# Altium schematic sheet 15.RK3588_SARADC_1.8V Only GPIO.SchDoc
size 420 x 297 mm; Revision: V2.1; Schematic Page Number: 11; Page Number: 15; Check: <Checker>; Schematic Name: RK_NVR_DEMO1_RK3588_LP4/4x_V21; Page Count: 43; Page name: 15.RK3588_SARADC/1.8V Only GPIO; Designer: Zhangdz; Schematic Page Count: 99; Revcode: V2.1; DsnPath: E:\Work\SBER\RK3588_SOM\temp\RK_NVR_DEMO1_RK3588_LP4XD200P232SD8_V21_20211228.DSN; SchematicName: RK_NVR_DEMO1_RK3588_LP4/4x_V21; PageName: 15.RK3588_SARADC/1.8V Only GPIO; PageSize: A3; TopSchematic: True
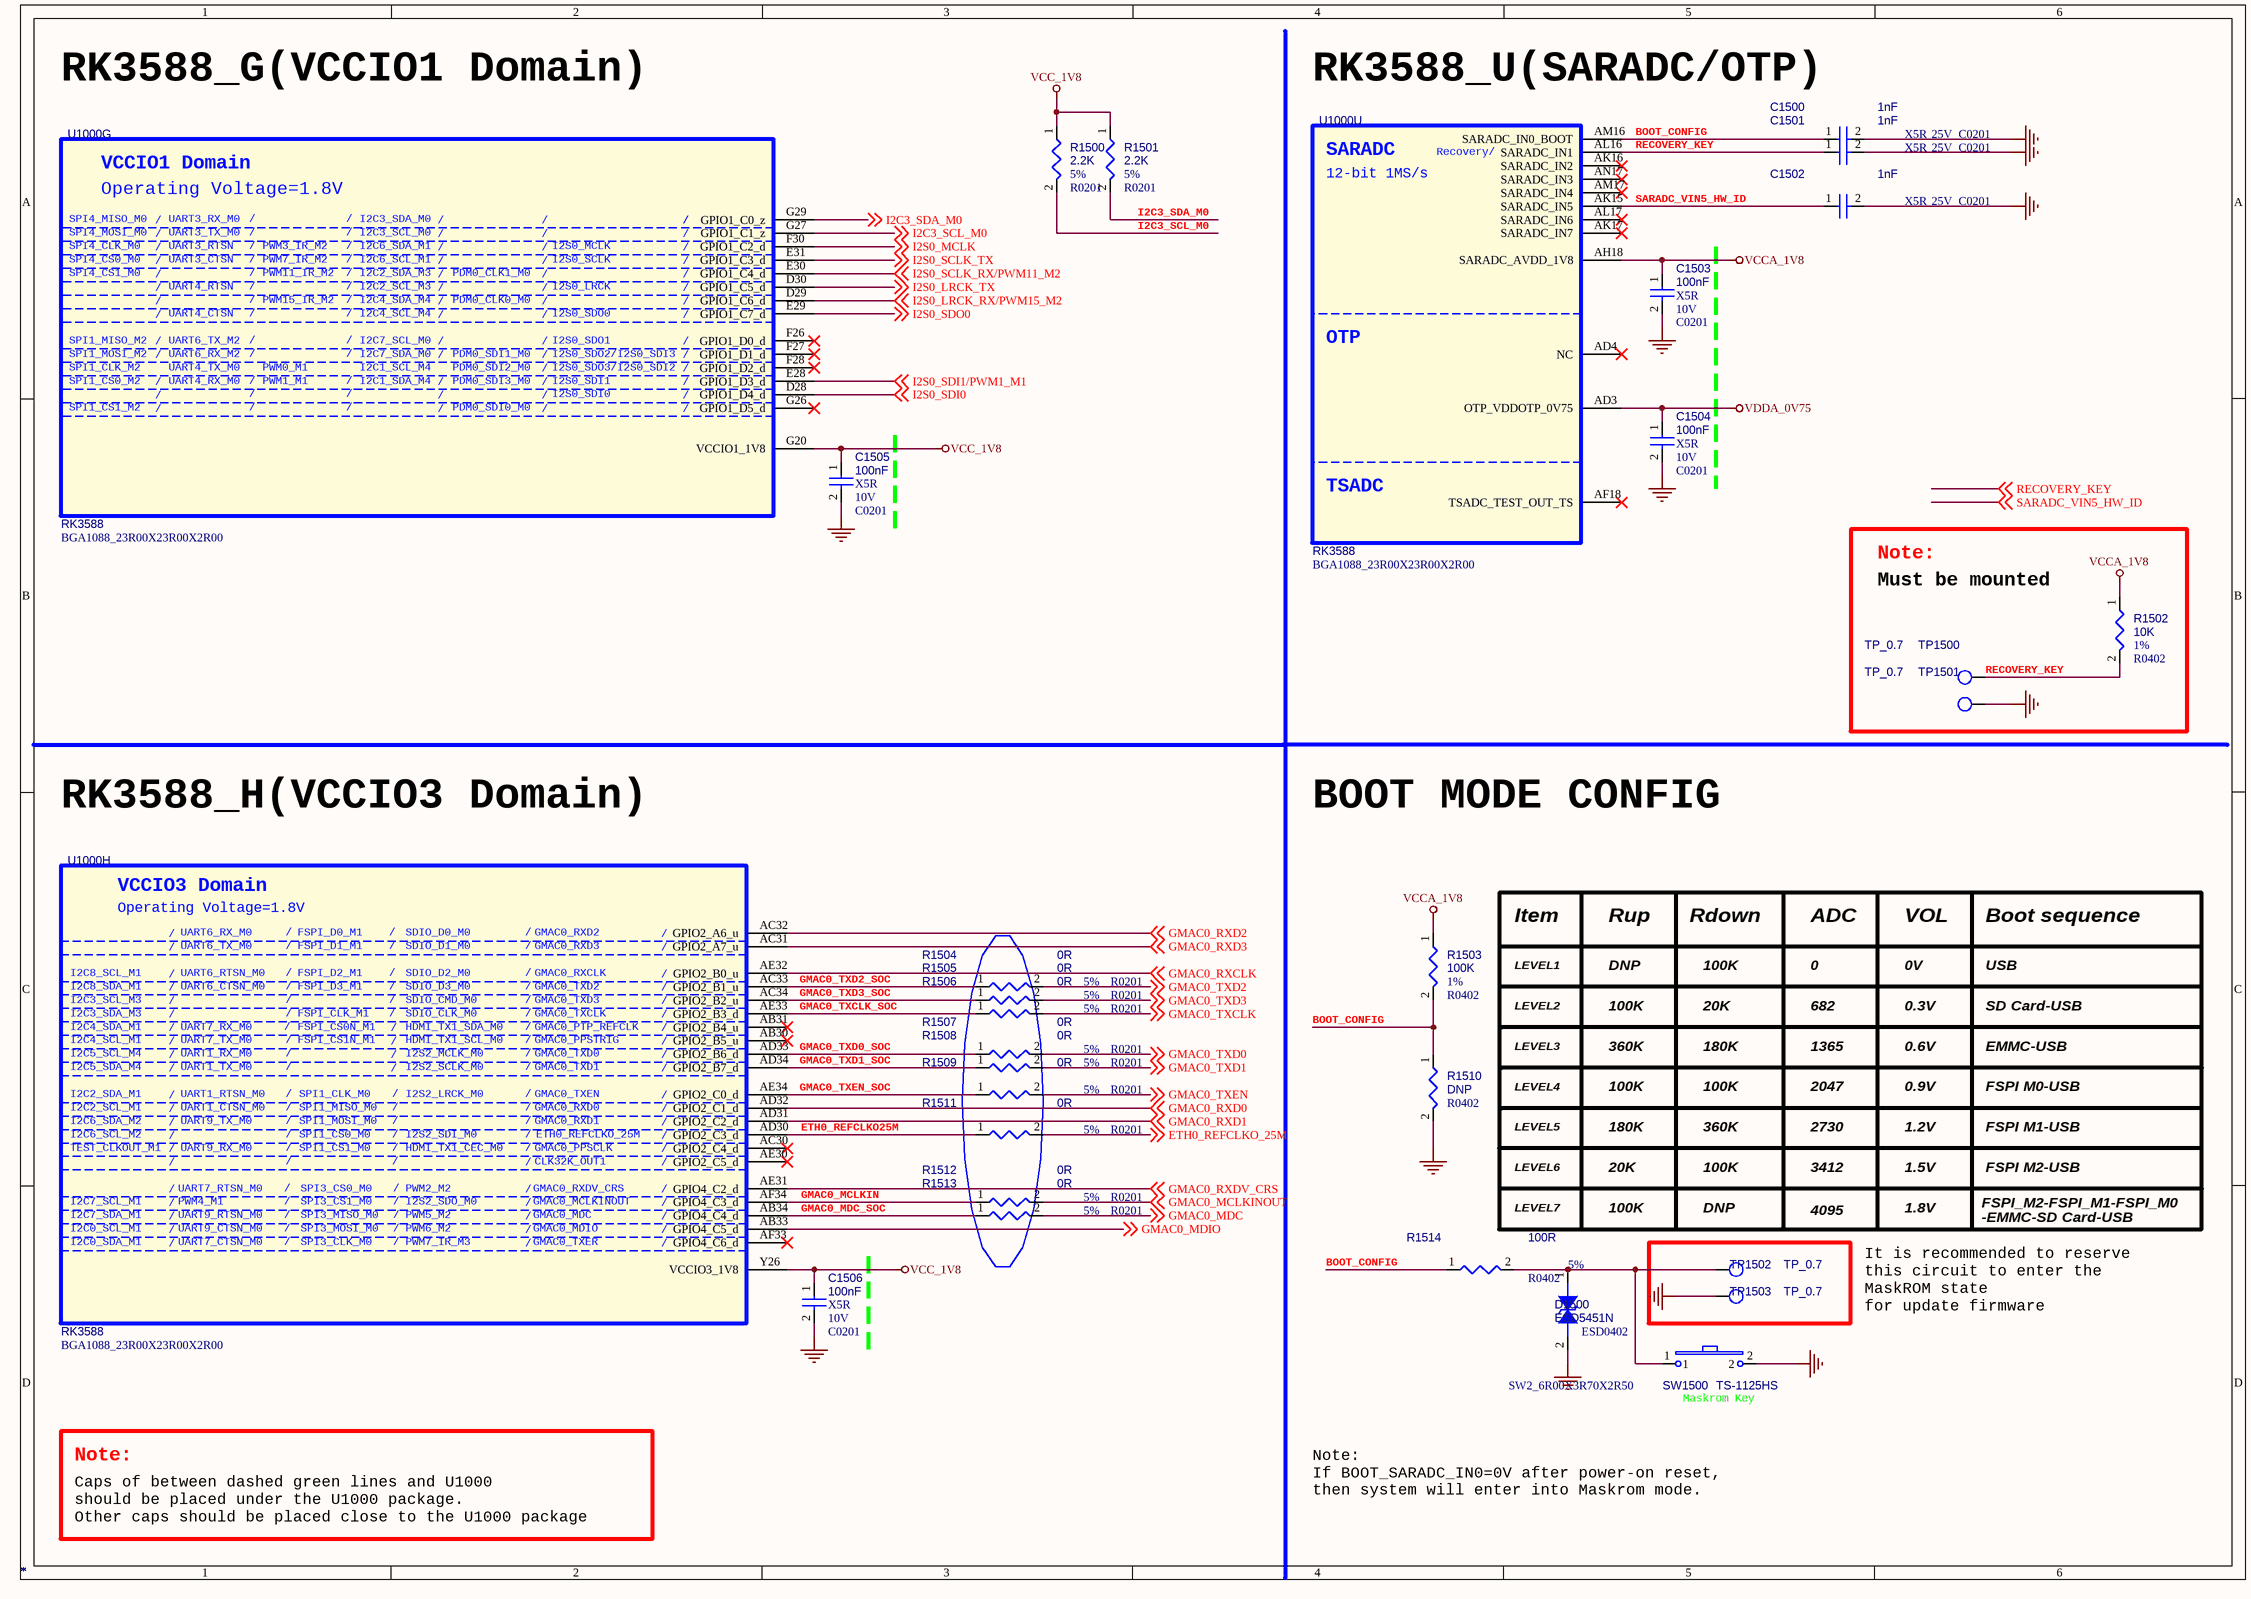
[diagram p0: 15.RK3588_SARADC_1.8V Only GPIO.SchDoc]

## Parts
C1500  *  Voltage: 25V  Dielectric: X5R  [C0201]
C1501  *  Voltage: 25V  Dielectric: X5R  [C0201]
C1502  *  Voltage: 25V  Dielectric: X5R  [C0201]
C1503  *  Voltage: 10V  Dielectric: X5R  [C0201]
C1504  *  Voltage: 10V  Dielectric: X5R  [C0201]
C1505  *  Voltage: 10V  Dielectric: X5R  [C0201]
C1506  *  Voltage: 10V  Dielectric: X5R  [C0201]
D1500  *  [ESD0402]
R1500  *  PCB Footprint: R0201  Tolerance: 5%  [R0402]
R1501  *  PCB Footprint: R0201  Tolerance: 5%  [R0402]
R1502  *  Tolerance: 1%  [R0402]
R1503  *  Tolerance: 1%  [R0402]
R1504  *  PCB Footprint: R0201  Tolerance: 5%  [R0402]
R1505  *  PCB Footprint: R0201  Tolerance: 5%  [R0402]
R1506  *  PCB Footprint: R0201  Tolerance: 5%  [R0402]
R1507  *  PCB Footprint: R0201  Tolerance: 5%  [R0402]
R1508  *  PCB Footprint: R0201  Tolerance: 5%  [R0402]
R1509  *  PCB Footprint: R0201  Tolerance: 5%  [R0402]
R1510  *  [R0402]
R1511  *  PCB Footprint: R0201  Tolerance: 5%  [R0402]
R1512  *  PCB Footprint: R0201  Tolerance: 5%  [R0402]
R1513  *  PCB Footprint: R0201  Tolerance: 5%  [R0402]
R1514  *  Tolerance: 5%  [R0402]
SW1500  *  PCB Footprint: SW2_6R00X3R70X2R50  Option: Maskrom Key  [YC-6615B]
TP1500  *  [TEST]
TP1501  *  [TEST]
TP1502  *  [TEST]
TP1503  *  [TEST]
U1000  *  [BGA1088_23R00X23R00X2R00]  (parts G,H,U of 26)

## Nets
GND: C1500.2 C1501.2 C1502.2 C1503.2 C1504.2 C1505.2 C1506.2 D1500.2 R1510.2 SW1500.2 TP1501.1 TP1503.1
VCC_1V8: C1505.1 C1506.1 R1500.1 R1501.1 U1000.G20(VCCIO1_1V8) U1000.Y26(VCCIO3_1V8)
VCCA_1V8: C1503.1 R1502.1 R1503.1 U1000.AH18(SARADC_AVDD_1V8)
VDDA_0V75: C1504.1 U1000.AD3(OTP_VDDOTP_0V75)
BOOT_CONFIG: C1500.1 R1503.2 R1510.1 R1514.1 U1000.AM16(SARADC_IN0_BOOT)
ETH0_REFCLKO25M: R1511.1 U1000.AD30(GPIO2_C3_d)
ETH0_REFCLKO_25M: R1511.2 ; off-sheet ETH0_REFCLKO_25M
GMAC0_MCLKIN: R1512.1 U1000.AF34(GPIO4_C3_d)
GMAC0_MCLKINOUT: R1512.2 ; off-sheet GMAC0_MCLKINOUT
GMAC0_MDC: R1513.2 ; off-sheet GMAC0_MDC
GMAC0_MDC_SOC: R1513.1 U1000.AB34(GPIO4_C4_d)
GMAC0_MDIO: U1000.AB33(GPIO4_C5_d) ; off-sheet GMAC0_MDIO
GMAC0_RXCLK: U1000.AE32(GPIO2_B0_u) ; off-sheet GMAC0_RXCLK
GMAC0_RXD0: U1000.AD32(GPIO2_C1_d) ; off-sheet GMAC0_RXD0
GMAC0_RXD1: U1000.AD31(GPIO2_C2_d) ; off-sheet GMAC0_RXD1
GMAC0_RXD2: U1000.AC32(GPIO2_A6_u) ; off-sheet GMAC0_RXD2
GMAC0_RXD3: U1000.AC31(GPIO2_A7_u) ; off-sheet GMAC0_RXD3
GMAC0_RXDV_CRS: U1000.AE31(GPIO4_C2_d) ; off-sheet GMAC0_RXDV_CRS
GMAC0_TXCLK: R1506.2 ; off-sheet GMAC0_TXCLK
GMAC0_TXCLK_SOC: R1506.1 U1000.AE33(GPIO2_B3_d)
GMAC0_TXD0: R1507.2 ; off-sheet GMAC0_TXD0
GMAC0_TXD0_SOC: R1507.1 U1000.AD33(GPIO2_B6_d)
GMAC0_TXD1: R1508.2 ; off-sheet GMAC0_TXD1
GMAC0_TXD1_SOC: R1508.1 U1000.AD34(GPIO2_B7_d)
GMAC0_TXD2: R1504.2 ; off-sheet GMAC0_TXD2
GMAC0_TXD2_SOC: R1504.1 U1000.AC33(GPIO2_B1_u)
GMAC0_TXD3: R1505.2 ; off-sheet GMAC0_TXD3
GMAC0_TXD3_SOC: R1505.1 U1000.AC34(GPIO2_B2_u)
GMAC0_TXEN: R1509.2 ; off-sheet GMAC0_TXEN
GMAC0_TXEN_SOC: R1509.1 U1000.AE34(GPIO2_C0_d)
I2C3_SCL_M0: R1500.2 U1000.G27(GPIO1_C1_z) ; off-sheet I2C3_SCL_M0
I2C3_SDA_M0: R1501.2 U1000.G29(GPIO1_C0_z) ; off-sheet I2C3_SDA_M0
I2S0_LRCK_RX/PWM15_M2: U1000.D29(GPIO1_C6_d) ; off-sheet I2S0_LRCK_RX/PWM15_M2
I2S0_LRCK_TX: U1000.D30(GPIO1_C5_d) ; off-sheet I2S0_LRCK_TX
I2S0_MCLK: U1000.F30(GPIO1_C2_d) ; off-sheet I2S0_MCLK
I2S0_SCLK_RX/PWM11_M2: U1000.E30(GPIO1_C4_d) ; off-sheet I2S0_SCLK_RX/PWM11_M2
I2S0_SCLK_TX: U1000.E31(GPIO1_C3_d) ; off-sheet I2S0_SCLK_TX
I2S0_SDI0: U1000.D28(GPIO1_D4_d) ; off-sheet I2S0_SDI0
I2S0_SDI1/PWM1_M1: U1000.E28(GPIO1_D3_d) ; off-sheet I2S0_SDI1/PWM1_M1
I2S0_SDO0: U1000.E29(GPIO1_C7_d) ; off-sheet I2S0_SDO0
RECOVERY_KEY: C1501.1 R1502.2 TP1500.1 U1000.AL16(SARADC_IN1) ; off-sheet RECOVERY_KEY
SARADC_VIN5_HW_ID: C1502.1 U1000.AK15(SARADC_IN5) ; off-sheet SARADC_VIN5_HW_ID
NetD1500_1: D1500.1 R1514.2 SW1500.1 TP1502.1

Not connected (* = marked no-connect by the designer): U1000 AB30(GPIO2_B5_u)* AB31(GPIO2_B4_u)* AC30(GPIO2_C4_d)* AD4(NC)* AE30(GPIO2_C5_d)* AF18(TSADC_TEST_OUT_TS)* AF33(GPIO4_C6_d)* AK16(SARADC_IN2)* AK17(SARADC_IN7)* AL17(SARADC_IN6)* AM17(SARADC_IN4)* AN17(SARADC_IN3)* F26(GPIO1_D0_d)* F27(GPIO1_D1_d)* F28(GPIO1_D2_d)* G26(GPIO1_D5_d)*

## Notes on the sheet
- RK3588_G(VCCIO1 Domain)
- (near U1000) RK3588_U(SARADC/OTP)
- Note:
- Must be mounted
- RK3588_H(VCCIO3 Domain)
- BOOT MODE CONFIG
- Item
- Rup
- Rdown
- ADC
- VOL
- Boot sequence
- LEVEL1
- DNP
- 100K
- 0
- 0V
- USB
- LEVEL2
- LEVEL3
- 360K
- 20K
- 180K
- 682
- 1365
- 0.6V
- 0.3V
- EMMC-USB
- SD Card-USB
- LEVEL4
- LEVEL5
- 2047
- 2730
- 1.2V
- 0.9V
- FSPI M1-USB
- FSPI M0-USB
- LEVEL6
- 3412
- 1.5V
- FSPI M2-USB
- LEVEL7
- 4095
- 1.8V
- FSPI_M2-FSPI_M1-FSPI_M0
  -EMMC-SD Card-USB
- It is recommended to reserve
  this circuit to enter the
  MaskROM state
  for update firmware
- Caps of between dashed green lines and U1000
  should be placed under the U1000 package.
  Other caps should be placed close to the U1000 package
- Note:
  If BOOT_SARADC_IN0=0V after power-on reset,
  then system will enter into Maskrom mode.
- (in symbol SOC_RK3588, part G) VCCIO1 Domain; Operating Voltage=1.8V; SPI4_MISO_M0; /; UART3_RX_M0; I2C3_SDA_M0; SPI4_MOSI_M0; UART3_TX_M0; I2C3_SCL_M0; SPI4_CLK_M0; UART3_RTSN; PWM3_IR_M2; I2C6_SDA_M1; I2S0_MCLK; SPI4_CS0_M0; UART3_CTSN; PWM7_IR_M2; I2C6_SCL_M1; I2S0_SCLK; SPI4_CS1_M0; PWM11_IR_M2; I2C2_SDA_M3; PDM0_CLK1_M0; UART4_RTSN; I2C2_SCL_M3; I2S0_LRCK; PWM15_IR_M2; I2C4_SDA_M4; PDM0_CLK0_M0; UART4_CTSN; I2C4_SCL_M4; I2S0_SDO0; SPI1_MISO_M2; UART6_TX_M2; I2C7_SCL_M0; I2S0_SDO1; SPI1_MOSI_M2; UART6_RX_M2; I2C7_SDA_M0; PDM0_SDI1_M0; I2S0_SDO2/I2S0_SDI3; SPI1_CLK_M2; UART4_TX_M0; PWM0_M1; I2C1_SCL_M4; PDM0_SDI2_M0; I2S0_SDO3/I2S0_SDI2; SPI1_CS0_M2; UART4_RX_M0; PWM1_M1; I2C1_SDA_M4; PDM0_SDI3_M0; I2S0_SDI1; I2S0_SDI0; SPI1_CS1_M2; PDM0_SDI0_M0
- (in symbol SOC_RK3588, part H) VCCIO3 Domain; Operating Voltage=1.8V; /; UART6_RX_M0; FSPI_D0_M1; SDIO_D0_M0; GMAC0_RXD2; UART6_TX_M0; FSPI_D1_M1; SDIO_D1_M0; GMAC0_RXD3; I2C8_SCL_M1; UART6_RTSN_M0; FSPI_D2_M1; SDIO_D2_M0; GMAC0_RXCLK; I2C8_SDA_M1; UART6_CTSN_M0; FSPI_D3_M1; SDIO_D3_M0; GMAC0_TXD2; I2C3_SCL_M3; SDIO_CMD_M0; GMAC0_TXD3; I2C3_SDA_M3; FSPI_CLK_M1; SDIO_CLK_M0; GMAC0_TXCLK; I2C4_SDA_M1; UART7_RX_M0; FSPI_CS0N_M1; HDMI_TX1_SDA_M0; GMAC0_PTP_REFCLK; I2C4_SCL_M1; UART7_TX_M0; FSPI_CS1N_M1; HDMI_TX1_SCL_M0; GMAC0_PPSTRIG; I2C5_SCL_M4; UART1_RX_M0; I2S2_MCLK_M0; GMAC0_TXD0; I2C5_SDA_M4; UART1_TX_M0; I2S2_SCLK_M0; GMAC0_TXD1; I2C2_SDA_M1; UART1_RTSN_M0; SPI1_CLK_M0; I2S2_LRCK_M0; GMAC0_TXEN; I2C2_SCL_M1; UART1_CTSN_M0; SPI1_MISO_M0; GMAC0_RXD0; I2C6_SDA_M2; UART9_TX_M0; SPI1_MOSI_M0; GMAC0_RXD1; I2C6_SCL_M2; SPI1_CS0_M0; I2S2_SDI_M0; ETH0_REFCLKO_25M; TEST_CLKOUT_M1; UART9_RX_M0; SPI1_CS1_M0; HDMI_TX1_CEC_M0; GMAC0_PPSCLK; CLK32K_OUT1; UART7_RTSN_M0; SPI3_CS0_M0; PWM2_M2; GMAC0_RXDV_CRS; I2C7_SCL_M1; PWM4_M1; SPI3_CS1_M0; I2S2_SDO_M0; GMAC0_MCLKINOUT; I2C7_SDA_M1; UART9_RTSN_M0; SPI3_MISO_M0; PWM5_M2; GMAC0_MDC; I2C0_SCL_M1; UART9_CTSN_M0; SPI3_MOSI_M0; PWM6_M2; GMAC0_MDIO; I2C0_SDA_M1; UART7_CTSN_M0; SPI3_CLK_M0; PWM7_IR_M3; GMAC0_TXER
- (in symbol SOC_RK3588, part U) SARADC; Recovery/; 12-bit 1MS/s; OTP; TSADC

## Library data of the parts
C1500 = CAP NP: cap,1.00nF,+/-10%,25V,X5R,C0201; Part Reference: C1500; Manufacturer: TDK; Value: 1nF; RK PN: C0603X5R1E102K030BA; Priority: A; Tolerance: 10%; PCB Footprint: C0201; Part Type: C0201; Manufacturer PN: C0603X5R1E102K030BA; Created by: JJJ
C1501 = CAP NP: cap,1.00nF,+/-10%,25V,X5R,C0201; Part Reference: C1501; Manufacturer: TDK; Value: 1nF; RK PN: C0603X5R1E102K030BA; Priority: A; Tolerance: 10%; PCB Footprint: C0201; Part Type: C0201; Manufacturer PN: C0603X5R1E102K030BA; Created by: JJJ
C1502 = CAP NP: cap,1.00nF,+/-10%,25V,X5R,C0201; Part Reference: C1502; Manufacturer: TDK; Value: 1nF; RK PN: C0603X5R1E102K030BA; Priority: A; Tolerance: 10%; PCB Footprint: C0201; Part Type: C0201; Manufacturer PN: C0603X5R1E102K030BA; Created by: JJJ
C1503 = CAP NP: cap,100.00nF,+/-10%,10V,X5R,C0201; Part Reference: C1503; Manufacturer: TDK; Value: 100nF; RK PN: C0603X5R1A104K030BC; Priority: A; Tolerance: 10%; PCB Footprint: C0201; Part Type: C0201; Manufacturer PN: C0603X5R1A104K030BC; Created by: JJJ
C1504 = CAP NP: cap,100.00nF,+/-10%,10V,X5R,C0201; Part Reference: C1504; Manufacturer PN: C0603X5R1A104K030BC; Manufacturer: TDK; Value: 100nF; Tolerance: 10%; Priority: A; PCB Footprint: C0201; Created by: JJJ; Part Type: C0201; RK PN: C0603X5R1A104K030BC
C1505 = CAP NP: cap,100.00nF,+/-10%,10V,X5R,C0201; Part Reference: C1505; Manufacturer PN: C0603X5R1A104K030BC; Manufacturer: TDK; Value: 100nF; Tolerance: 10%; Priority: A; PCB Footprint: C0201; Created by: JJJ; Part Type: C0201; RK PN: C0603X5R1A104K030BC
C1506 = CAP NP: cap,100.00nF,+/-10%,10V,X5R,C0201; Part Reference: C1506; Manufacturer: TDK; Value: 100nF; RK PN: C0603X5R1A104K030BC; Priority: A; Tolerance: 10%; PCB Footprint: C0201; Part Type: C0201; Manufacturer PN: C0603X5R1A104K030BC; Created by: JJJ
D1500 = DIODE BI_DIR TRIG: 1-Line, Bi-directional, Transient Voltage Suppressors.17.5pF.; Part Reference: D1500; Manufacturer: WillSemi(О¤¶ы°лµјМе); Value: ESD5451N; Priority: A; PCB Footprint: ESD0402; Created by: JJJ; Manufacturer PN: ESD5451N; Part Type: ESD_TVS; RK PN: ESD5451N
R1500 = RESISTOR_Dup1: НЁУГєсД¤µзЧи,2K2,+/-5%,R0201,1/20W.; Part Reference: R1500; Manufacturer: YAGEO; Value: 2.2K; RK PN: RC0201JR-072K2L; Priority: A; Wattage: 1/20W; Part Type: НЁУГєсД¤µзЧи; Manufacturer PN: RC0201JR-072K2L; Created by: YTL
R1501 = RESISTOR_Dup1: НЁУГєсД¤µзЧи,2K2,+/-5%,R0201,1/20W.; Part Reference: R1501; Manufacturer PN: RC0201JR-072K2L; Manufacturer: YAGEO; Value: 2.2K; Wattage: 1/20W; Priority: A; Created by: YTL; Part Type: НЁУГєсД¤µзЧи; RK PN: RC0201JR-072K2L
R1502 = RESISTOR_Dup1: НЁУГєсД¤µзЧи,10K,+/-1%,R0402,1/16W.; Part Reference: R1502; Manufacturer PN: RC0402FR-0710KL; Manufacturer: YAGEO; Wattage: 1/16W; Priority: A; PCB Footprint: R0402; Value: 10K; Created by: YTL; Part Type: НЁУГєсД¤µзЧи; RK PN: RC0402FR-0710KL
R1503 = RESISTOR_Dup1: НЁУГєсД¤µзЧи,100K,+/-1%,R0402,1/16W.; Part Reference: R1503; Manufacturer: YAGEO; RK PN: RC0402FR-07100KL; Priority: A; Wattage: 1/16W; PCB Footprint: R0402; Value: 100K; Part Type: НЁУГєсД¤µзЧи; Manufacturer PN: RC0402FR-07100KL; Created by: YTL
R1504 = RESISTOR_Dup1: НЁУГєсД¤µзЧи,0R,+/-5%,R0201,1/20W.; Part Reference: R1504; Manufacturer: YAGEO; RK PN: RC0201JR-070RL; Priority: A; Wattage: 1/20W; Value: 0R; Part Type: НЁУГєсД¤µзЧи; Manufacturer PN: RC0201JR-070RL; Created by: YTL
R1505 = RESISTOR_Dup1: НЁУГєсД¤µзЧи,0R,+/-5%,R0201,1/20W.; Part Reference: R1505; Manufacturer PN: RC0201JR-070RL; Manufacturer: YAGEO; Wattage: 1/20W; Priority: A; Value: 0R; Created by: YTL; Part Type: НЁУГєсД¤µзЧи; RK PN: RC0201JR-070RL
R1506 = RESISTOR_Dup1: НЁУГєсД¤µзЧи,0R,+/-5%,R0201,1/20W.; Part Reference: R1506; Manufacturer: YAGEO; RK PN: RC0201JR-070RL; Priority: A; Wattage: 1/20W; Value: 0R; Part Type: НЁУГєсД¤µзЧи; Manufacturer PN: RC0201JR-070RL; Created by: YTL
R1507 = RESISTOR_Dup1: НЁУГєсД¤µзЧи,0R,+/-5%,R0201,1/20W.; Part Reference: R1507; Manufacturer: YAGEO; RK PN: RC0201JR-070RL; Priority: A; Wattage: 1/20W; Value: 0R; Part Type: НЁУГєсД¤µзЧи; Manufacturer PN: RC0201JR-070RL; Created by: YTL
R1508 = RESISTOR_Dup1: НЁУГєсД¤µзЧи,0R,+/-5%,R0201,1/20W.; Part Reference: R1508; Manufacturer: YAGEO; RK PN: RC0201JR-070RL; Priority: A; Wattage: 1/20W; Value: 0R; Part Type: НЁУГєсД¤µзЧи; Manufacturer PN: RC0201JR-070RL; Created by: YTL
R1509 = RESISTOR_Dup1: НЁУГєсД¤µзЧи,0R,+/-5%,R0201,1/20W.; Part Reference: R1509; Manufacturer: YAGEO; RK PN: RC0201JR-070RL; Priority: A; Wattage: 1/20W; Value: 0R; Part Type: НЁУГєсД¤µзЧи; Manufacturer PN: RC0201JR-070RL; Created by: YTL
R1510 = RESISTOR_Dup1: Did Not Place.; Part Reference: R1510; Manufacturer PN: DNPR0402; Value: DNP; Priority: A; PCB Footprint: R0402; Created by: JJJ; Part Type: DNP; RK PN: DNPR0402
R1511 = RESISTOR_Dup1: НЁУГєсД¤µзЧи,0R,+/-5%,R0201,1/20W.; Part Reference: R1511; Manufacturer PN: RC0201JR-070RL; Manufacturer: YAGEO; Wattage: 1/20W; Priority: A; Value: 0R; Created by: YTL; Part Type: НЁУГєсД¤µзЧи; RK PN: RC0201JR-070RL
R1512 = RESISTOR_Dup1: НЁУГєсД¤µзЧи,0R,+/-5%,R0201,1/20W.; Part Reference: R1512; Manufacturer PN: RC0201JR-070RL; Manufacturer: YAGEO; Wattage: 1/20W; Priority: A; Value: 0R; Created by: YTL; Part Type: НЁУГєсД¤µзЧи; RK PN: RC0201JR-070RL
R1513 = RESISTOR_Dup1: НЁУГєсД¤µзЧи,0R,+/-5%,R0201,1/20W.; Part Reference: R1513; Manufacturer PN: RC0201JR-070RL; Manufacturer: YAGEO; Wattage: 1/20W; Priority: A; Value: 0R; Created by: YTL; Part Type: НЁУГєсД¤µзЧи; RK PN: RC0201JR-070RL
R1514 = RESISTOR_Dup1: НЁУГєсД¤µзЧи,100R,+/-5%,R0402,1/16W.; Part Reference: R1514; Manufacturer: YAGEO; RK PN: RC0402JR-07100RL; Priority: A; Wattage: 1/16W; PCB Footprint: R0402; Value: 100R; Part Type: НЁУГєсД¤µзЧи; Manufacturer PN: RC0402JR-07100RL; Created by: YTL
SW1500 = KEY_2PIN: 2ЅЕМщЖ¬Ј¬6MMx3.7MM°ґјь; Part Reference: SW1500; Manufacturer: Сw»ЄµзЧУ; Value: TS-1125HS; Priority: A; Created by: YWQ; Manufacturer Part Number: TS-1125HS; Part Type: KEY; RK PN: TS-1125HS
TP1500 = TP: Test Point 0.7mm; Part Reference: TP1500; PCB Footprint: TP_0R70; Value: TP_0.7; Priority: A; RK PN: TESTPOINT_0R7; Created by: JJJ; Part Type: TP
TP1501 = TP: Test Point 0.7mm; Part Reference: TP1501; PCB Footprint: TP_0R70; Value: TP_0.7; Priority: A; RK PN: TESTPOINT_0R7; Created by: JJJ; Part Type: TP
TP1502 = TP: Test Point 0.7mm; Part Reference: TP1502; PCB Footprint: TP_0R70; Value: TP_0.7; RK PN: TESTPOINT_0R7; Priority: A; Part Type: TP; Created by: JJJ
TP1503 = TP: Test Point 0.7mm; Part Reference: TP1503; PCB Footprint: TP_0R70; Value: TP_0.7; Priority: A; RK PN: TESTPOINT_0R7; Created by: JJJ; Part Type: TP
U1000 = SOC_RK3588: ROCKCHIP SOC; Part Reference: U1000; Manufacturer: Rockchip (ИрРѕОў); SPLIT_INST: TRUE; SWAP_INFO: (S1+S2+S3+S4+S5+S6+S7+S8+S9+S10+S11+S12+S13+S14+S15+S16+S17+S18+S19+S20+S21+S22+S23+S24+S25+S26); Value: RK3588; Priority: A; Created by: YWQ; Manufacturer PN: RK3588; Part Type: SOC; RK PN: RK3588; PCB Footprint: BGA1088_23R00X23R00X2R00